# Altium schematic sheet Node.SchDoc: Mesh Netwok Node
size B; DrawnBy: DBK; Engineer: DBK; Revision: 1; SheetNumber: 1; SheetTotal: 1; Rule: PcbType=ProtelPcb
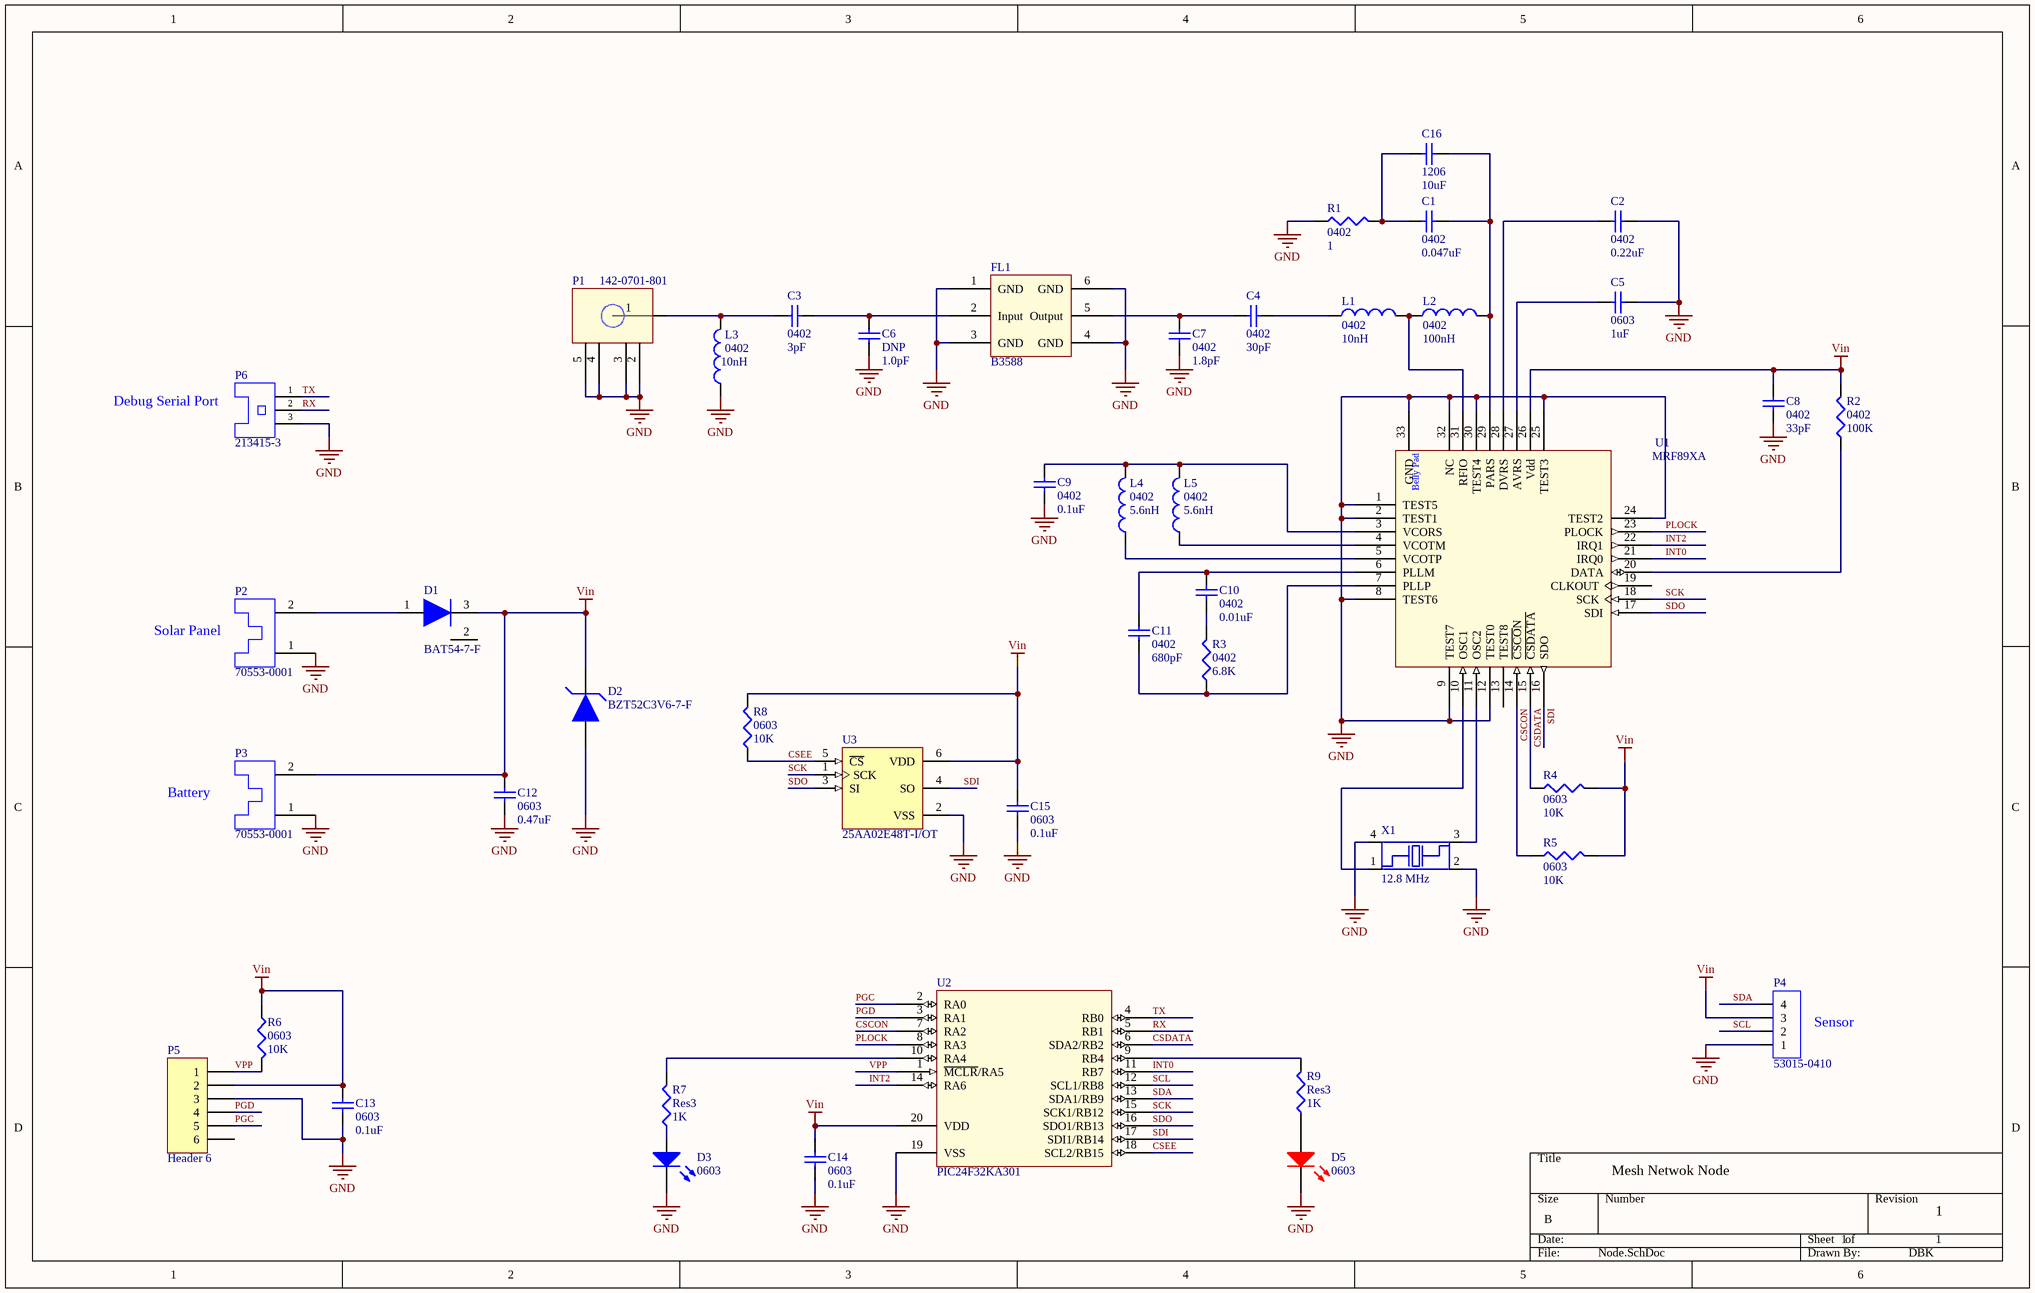
[diagram p0: Node.SchDoc]

## Parts
C1  0402  value 0.047uF  [0402]
C2  0402  value 0.22uF  [0402]
C3  0402  value 3pF  [0402]
C4  0402  value 30pF  [0402]
C5  0603  value 1uF  [0402]
C6  DNP  value 1.0pF  [0402]
C7  0402  value 1.8pF  [0402]
C8  0402  value 33pF  [0402]
C9  0402  value 0.1uF  [0402]
C10  0402  value 0.01uF  [0402]
C11  0402  value 680pF  [0402]
C12  0603  value 0.47uF  [1608[0603]]
C13  0603  value 0.1uF  [1608[0603]]
C14  0603  value 0.1uF  [1608[0603]]
C15  0603  value 0.1uF  [1608[0603]]
C16  1206  value 10uF  [1206 CAP]
D1  BAT54-7-F  [SOT90P240X110-3N]
D2  BZT52C3V6-7-F  [SOD-123]
D3  0603  [0603 LED]
D5  0603  [0603 LED]
FL1  B3588  [B3717]
L1  0402  value 10nH  [0402-A]
L2  0402  value 100nH  [0402-A]
L3  0402  value 10nH  [0402-A]
L4  0402  value 5.6nH  [0402-A]
L5  0402  value 5.6nH  [0402-A]
P1  142-0701-801  [142-0701-801]
P2  70553-0001  [070553-0001]
P3  70553-0001  [070553-0001]
P4  53015-0410  [53015-0410]
P5  Header 6  [HDR1X6]
P6  213415-3  [2132415-3]
R1  0402  value 1  [0402]
R2  0402  value 100K  [0402]
R3  0402  value 6.8K  [0402]
R4  0603  value 10K  [J1-0603]
R5  0603  value 10K  [J1-0603]
R6  0603  value 10K  [J1-0603]
R7  Res3  value 1K  [J1-0603]
R8  0603  value 10K  [J1-0603]
R9  Res3  value 1K  [J1-0603]
U1  MRF89XA  [QFN50P500X500X75-32N]
U2  PIC24F32KA301  [SOP127P600-8N]
U3  25AA02E48T-I/OT  [SOT-23-OT6_N]
X1  12.8 MHz  [ABM3B]

## Nets
GND: C2.2 C5.1 C6.1 C7.1 C8.2 C9.1 C12.1 C13.1 C14.1 C15.1 D2.1 D3.1(K) D5.1(K) FL1.1(GND) FL1.3(GND) FL1.4(GND) FL1.6(GND) L3.1 P1.2 P1.3 P1.4 P1.5 P2.1 P3.1 P4.1 P5.3 P6.3 R1.1 U1.1(TEST5) U1.2(TEST1) U1.8(TEST6) U1.9(TEST7) U1.12(TEST0) U1.24(TEST2) U1.25(TEST3) U1.30(TEST4) U1.32(NC) U1.33(GND) U2.19(VSS) U3.2(VSS) X1.2 X1.4
Vin: C8.1 C12.2 C13.2 C14.2 C15.2 D1.3 D2.2 P3.2 P4.3 P5.2 R2.2 R4.2 R5.2 R6.1 R8.2 U1.26(Vdd) U2.20(VDD) U3.6(VDD)
CSCON: R5.1 U1.14(~{CSCO}N) U2.7(RA2)
CSDATA: R4.1 U1.15(~{CSDATA}) U2.6(SDA2/RB2)
CSEE: R8.1 U2.18(SCL2/RB15) U3.5(~{CS})
INT0: U1.21(IRQ0) U2.11(RB7)
INT2: U1.22(IRQ1) U2.14(RA6)
PGC: P5.5 U2.2(RA0)
PGD: P5.4 U2.3(RA1)
PLOCK: U1.23(PLOCK) U2.8(RA3)
RX: P6.2 U2.5(RB1)
SCK: U1.18(SCK) U2.15(SCK1/RB12) U3.1(SCK)
SCL: P4.2 U2.12(SCL1/RB8)
SDA: P4.4 U2.13(SDA1/RB9)
SDI: U1.16(SDO) U2.17(SDI1/RB14) U3.4(SO)
SDO: U1.17(SDI) U2.16(SDO1/RB13) U3.3(SI)
TX: P6.1 U2.4(RB0)
VPP: P5.1 R6.2 U2.1(~{MCLR}/RA5)
NetC1_1: C1.1 C16.1 R1.2
NetC1_2: C1.2 C16.2 L2.2 U1.29(PARS)
NetC2_1: C2.1 U1.28(DVRS)
NetC3_1: C3.1 L3.2 P1.1(Pin)
NetC3_2: C3.2 C6.2 FL1.2(Input)
NetC4_1: C4.1 C7.2 FL1.5(Output)
NetC4_2: C4.2 L1.1
NetC5_2: C5.2 U1.27(AVRS)
NetC9_2: C9.2 L4.2 L5.2 U1.3(VCORS)
NetC10_1: C10.1 C11.1 U1.6(PLLM)
NetC10_2: C10.2 R3.2
NetC11_2: C11.2 R3.1 U1.7(PLLP)
NetD1_1: D1.1 P2.2
NetD3_2: D3.2(A) R7.1
NetD5_2: D5.2(A) R9.1
NetL1_2: L1.2 L2.1 U1.31(RFIO)
NetL4_1: L4.1 U1.5(VCOTP)
NetL5_1: L5.1 U1.4(VCOTM)
NetR2_1: R2.1 U1.20(DATA)
NetR7_2: R7.2 U2.10(RA4)
NetR9_2: R9.2 U2.9(RB4)
NetU1_10: U1.10(OSC1) X1.1
NetU1_11: U1.11(OSC2) X1.3

Not connected (* = marked no-connect by the designer): D1 2; P5 6; U1 13(TEST8) 19(CLKOUT)

## Notes on the sheet
- (near P6) Debug Serial Port
- (near P2) Solar Panel
- Battery
- (near P4) Sensor
- (in symbol MRF89XA) Belly Pad

## Library data of the parts
C1-C15 = Cap Semi: Capacitor (Semiconductor SIM Model); Published: 8-Jun-2000; LatestRevisionDate: 29-May-2009; LatestRevisionNote: IPC-7351 Footprint Added.; PackageReference: C1206; Publisher: Altium Limited; PackageDescription: Chip Capacitor
C16 = 1206 Capacitor: Surface Mount Ceramic Capacitor; Manufacturer 1: *; Manufacturer Part Number 1: *
D1 = BAT54-7-F: Schottky Barrier Diode, 200mA
D2 = BZT52C3V6-7-F: Zener Diode, 3.6V, 500 mW
D3 = Blue LED: Published: 8-Jun-2000; LatestRevisionDate: 08-Jul-2005; LatestRevisionNote: Mech Layer 1 removed.; PackageReference: LED-0; Publisher: Altium Limited; PackageDescription: LED; 2 Leads
D5 = Red LED: Published: 8-Jun-2000; LatestRevisionDate: 08-Jul-2005; LatestRevisionNote: Mech Layer 1 removed.; PackageReference: LED-0; Publisher: Altium Limited; PackageDescription: LED; 2 Leads
FL1 = B3588: 915 MHz Saw Filter; EPOCS: http://www.epcos.com/inf/40/ds/ae/B3717.pdf
L1-L5 = Inductor: Code_IEC: 1005; Published: 8-Jun-2000; LatestRevisionDate: 29-May-2009; LatestRevisionNote: IPC-7351 Footprint Added.; PackageReference: 0402-A; Publisher: Altium Limited; PackageDescription: Chip Inductor; Code_JEITA: 0402
P1 = 142-0701-801: SMA 50 ohm Female Socket, End Launch
P2 P3 = 70553-0001: Header, Shrouded, 2 Pin, RA
P4 = 53015-0410: 4 Position, 2.00 mm Header, RA
P5 = Header 6: Header, 6-Pin; LatestRevisionDate: 17-Jul-2002; LatestRevisionNote: Re-released for DXP Platform.; Publisher: Altium Limited
P6 = 213415-3: 3 Position Vertical Header, 2.5 mm
R1-R9 = Res3: Resistor; Published: 8-Jun-2000; LatestRevisionDate: 29-May-2009; LatestRevisionNote: IPC-7351 Footprint Added.; PackageReference: J1-0603; Publisher: Altium Limited; PackageDescription: Chip Resistor
U1 = MRF89XA: ISM Sub-GHz Transceiver
U2 = PIC24F32KA301: PIC Microcontroller, 32K Flash, 20 pin
U3 = 25AA02E48T-I/OT: 2K SPI Bus Serial EEPROM with EUI-48 Node Identity, 6-Pin SOT-23, Industrial Temperature, Tape and Reel; Manufacturer: Microchip; DatasheetVersion: revA, Dec-2008; PackageVersion: revBB, Aug-2009; PackageReference: SOT-23-OT6; PackageDescription: 6-Lead Plastic Small Outline Transistor (OT) [SOT-23]; Supplier 1: Digi-Key; Supplier Part Number 1: 25AA02E48T-I/OTTR-ND; Supplier 2: Digi-Key; Supplier Part Number 2: 25AA02E48T-I/OTCT-ND; Supplier 3: Digi-Key; Supplier Part Number 3: 25AA02E48T-I/OTDKR-ND; Supplier 4: Farnell; Supplier Part Number 4: 1700995RL; Supplier 5: Farnell; Supplier Part Number 5: 1700995; Supplier 6: Newark; Supplier Part Number 6: 45P4905; Supplier 7: Mouser; Supplier Part Number 7: 579-25AA02E48T-I/OT; Mounting Technology: Surface Mount; Code_IPC: SOT26A-6; PartNumber: 25AA02E48T-I/OT; ComponentLink1Description: Manufacturer URL; ComponentLink1URL: http://www.microchip.com/; ComponentLink2Description: Datasheet; ComponentLink2URL: http://ww1.microchip.com/downloads/en/DeviceDoc/22123A.pdf; ComponentLink3Description: Package Specification; ComponentLink3URL: http://www.microchip.com/stellent/groups/techpub_sg/documents/packagingspec/en012702.pdf
X1 = ABM3B-155-12.800MHz-T: Abracon 12.8 MHz, 10ppm